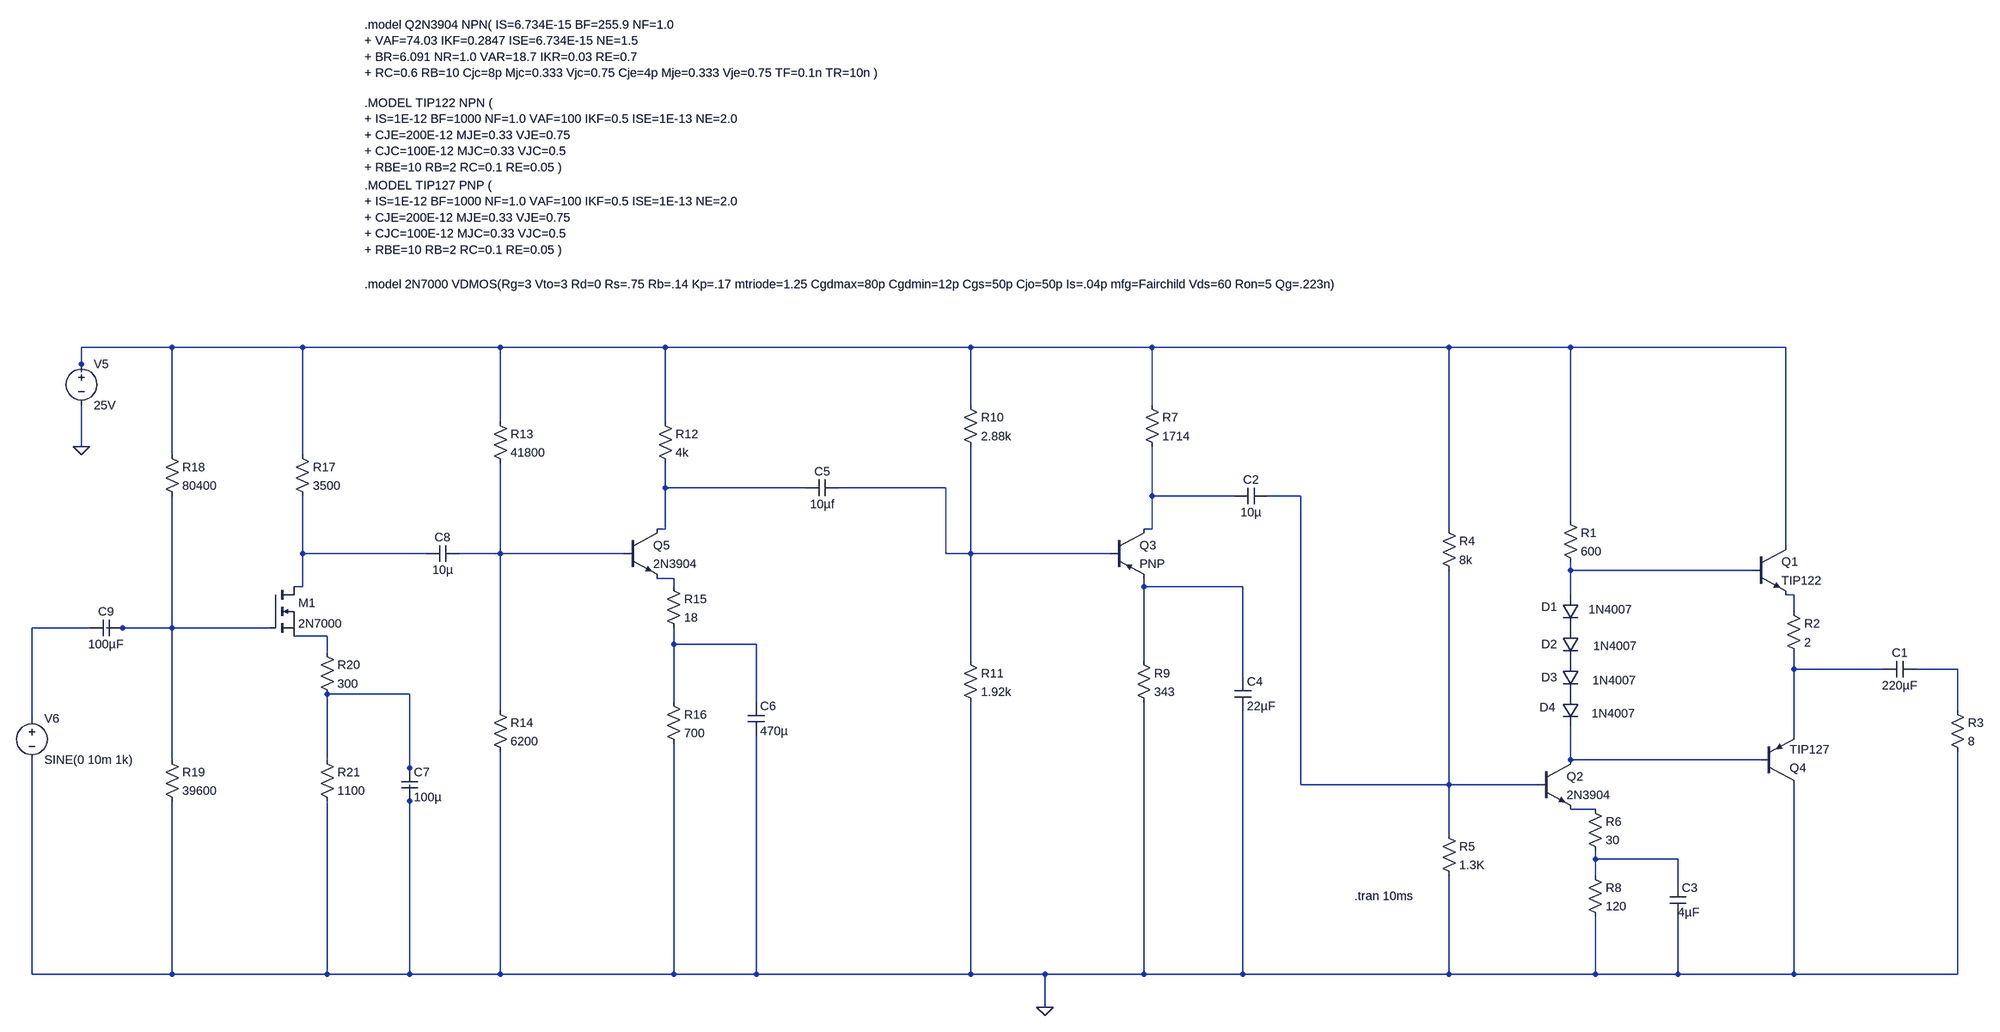
[diagram p0: schematic Audio_amp (1).asc]
Audio_amp (1).asc, the LTspice schematic file:
Version 4.1
SHEET 1 1880 1508
WIRE -2640 160 -2816 160
WIRE -2384 160 -2640 160
WIRE -2000 160 -2384 160
WIRE -1680 160 -2000 160
WIRE -1088 160 -1680 160
WIRE -736 160 -1088 160
WIRE -160 160 -736 160
WIRE 144 160 -160 160
WIRE 656 160 144 160
WIRE -2816 192 -2816 160
WIRE -2816 208 -2816 192
WIRE -1088 272 -1088 160
WIRE -736 272 -736 160
WIRE -2000 304 -2000 160
WIRE -1680 304 -1680 160
WIRE -2816 352 -2816 272
WIRE -2640 368 -2640 160
WIRE -2384 368 -2384 160
WIRE -1680 432 -1680 384
WIRE -1408 432 -1680 432
WIRE -1136 432 -1344 432
WIRE -736 448 -736 352
WIRE -576 448 -736 448
WIRE -448 448 -512 448
WIRE 144 496 144 160
WIRE -1680 512 -1680 432
WIRE -1680 512 -1696 512
WIRE -736 512 -736 448
WIRE -736 512 -752 512
WIRE -160 512 -160 160
WIRE 656 544 656 160
WIRE -2384 560 -2384 448
WIRE -2144 560 -2384 560
WIRE -2000 560 -2000 384
WIRE -2000 560 -2080 560
WIRE -1760 560 -2000 560
WIRE -1136 560 -1136 432
WIRE -1088 560 -1088 352
WIRE -1088 560 -1136 560
WIRE -816 560 -1088 560
WIRE 144 592 144 576
WIRE 592 592 144 592
WIRE -1664 608 -1696 608
WIRE -2384 624 -2384 560
WIRE -2384 624 -2400 624
WIRE -1664 624 -1664 608
WIRE -752 624 -752 608
WIRE -560 624 -752 624
WIRE 144 640 144 592
WIRE 672 640 656 640
WIRE 672 672 672 640
WIRE -2800 704 -2912 704
WIRE -2736 704 -2768 704
WIRE -2640 704 -2640 448
WIRE -2640 704 -2736 704
WIRE -2448 704 -2640 704
WIRE -2336 720 -2400 720
WIRE -1664 736 -1664 704
WIRE -1504 736 -1664 736
WIRE -2336 752 -2336 720
WIRE -1088 768 -1088 560
WIRE -752 768 -752 624
WIRE 672 784 672 752
WIRE 864 784 672 784
WIRE 1008 784 928 784
WIRE -560 800 -560 624
WIRE -2176 832 -2336 832
WIRE -1664 848 -1664 736
WIRE -1504 848 -1504 736
WIRE -2000 864 -2000 560
WIRE 1008 864 1008 784
WIRE -2912 880 -2912 704
WIRE 672 912 672 784
WIRE -2640 960 -2640 704
WIRE -2336 960 -2336 832
WIRE 144 960 144 896
WIRE 608 960 144 960
WIRE -2176 976 -2176 832
WIRE -2176 992 -2176 976
WIRE -448 1008 -448 448
WIRE -160 1008 -160 592
WIRE -160 1008 -448 1008
WIRE 80 1008 -160 1008
WIRE -2176 1040 -2176 1008
WIRE 192 1056 144 1056
WIRE -160 1104 -160 1008
WIRE 192 1152 192 1136
WIRE 352 1152 192 1152
WIRE 192 1184 192 1152
WIRE 352 1200 352 1152
WIRE -2912 1376 -2912 960
WIRE -2640 1376 -2640 1040
WIRE -2640 1376 -2912 1376
WIRE -2336 1376 -2336 1040
WIRE -2336 1376 -2640 1376
WIRE -2176 1376 -2176 1040
WIRE -2176 1376 -2336 1376
WIRE -2000 1376 -2000 944
WIRE -2000 1376 -2176 1376
WIRE -1664 1376 -1664 928
WIRE -1664 1376 -2000 1376
WIRE -1504 1376 -1504 912
WIRE -1504 1376 -1664 1376
WIRE -1088 1376 -1088 848
WIRE -1088 1376 -1504 1376
WIRE -944 1376 -1088 1376
WIRE -752 1376 -752 848
WIRE -752 1376 -944 1376
WIRE -560 1376 -560 864
WIRE -560 1376 -752 1376
WIRE -160 1376 -160 1184
WIRE -160 1376 -560 1376
WIRE 192 1376 192 1264
WIRE 192 1376 -160 1376
WIRE 352 1376 352 1264
WIRE 352 1376 192 1376
WIRE 672 1376 672 1008
WIRE 672 1376 352 1376
WIRE 1008 1376 1008 944
WIRE 1008 1376 672 1376
WIRE -944 1440 -944 1376
FLAG -2816 352 0
FLAG -944 1440 0
SYMBOL npn 592 544 R0
SYMATTR InstName Q1
SYMATTR Value TIP122
SYMBOL pnp 608 1008 M180
SYMATTR InstName Q4
SYMATTR Value TIP127
SYMBOL res 992 848 R0
SYMATTR InstName R3
SYMATTR Value 8
SYMBOL diode 128 640 R0
WINDOW 0 -41 23 Left 2
WINDOW 3 51 28 Left 2
SYMATTR InstName D1
SYMATTR Value 1N4007
SYMBOL diode 128 704 R0
WINDOW 0 -41 32 Left 2
WINDOW 3 60 35 Left 2
SYMATTR InstName D2
SYMATTR Value 1N4007
SYMBOL diode 128 768 R0
WINDOW 0 -41 32 Left 2
WINDOW 3 58 38 Left 2
SYMATTR InstName D3
SYMATTR Value 1N4007
SYMBOL diode 128 832 R0
WINDOW 0 -44 26 Left 2
WINDOW 3 57 38 Left 2
SYMATTR InstName D4
SYMATTR Value 1N4007
SYMBOL npn 80 960 R0
SYMATTR InstName Q2
SYMATTR Value 2N3904
SYMBOL cap -512 432 R90
WINDOW 0 0 32 VBottom 2
WINDOW 3 32 32 VTop 2
SYMATTR InstName C2
SYMATTR Value 10µ
SYMBOL res -176 496 R0
SYMATTR InstName R4
SYMATTR Value 8k
SYMBOL res -176 1088 R0
SYMATTR InstName R5
SYMATTR Value 1.3K
SYMBOL cap 336 1200 R0
WINDOW 3 16 56 Left 2
SYMATTR Value 4µF
SYMATTR InstName C3
SYMBOL res 656 656 R0
SYMATTR InstName R2
SYMATTR Value 2
SYMBOL res 176 1168 R0
SYMATTR InstName R8
SYMATTR Value 120
SYMBOL cap 928 768 R90
WINDOW 0 0 32 VBottom 2
WINDOW 3 32 32 VTop 2
SYMATTR InstName C1
SYMATTR Value 220µF
SYMBOL res 176 1040 R0
SYMATTR InstName R6
SYMATTR Value 30
SYMBOL pnp -816 512 R0
SYMATTR InstName Q3
SYMBOL res -752 256 R0
SYMATTR InstName R7
SYMATTR Value 1714
SYMBOL res -768 752 R0
SYMATTR InstName R9
SYMATTR Value 343
SYMBOL res -1104 256 R0
SYMATTR InstName R10
SYMATTR Value 2.88k
SYMBOL res -1104 752 R0
SYMATTR InstName R11
SYMATTR Value 1.92k
SYMBOL cap -576 800 R0
SYMATTR InstName C4
SYMATTR Value 22µF
SYMBOL cap -1344 416 R90
WINDOW 0 0 32 VBottom 2
WINDOW 3 32 32 VTop 2
SYMATTR InstName C5
SYMATTR Value 10µf
SYMBOL npn -1760 512 R0
SYMATTR InstName Q5
SYMATTR Value 2N3904
SYMBOL res -1696 288 R0
SYMATTR InstName R12
SYMATTR Value 4k
SYMBOL res -2016 288 R0
SYMATTR InstName R13
SYMATTR Value 41800
SYMBOL res -2016 848 R0
SYMATTR InstName R14
SYMATTR Value 6200
SYMBOL res -1680 608 R0
SYMATTR InstName R15
SYMATTR Value 18
SYMBOL res -1680 832 R0
SYMATTR InstName R16
SYMATTR Value 700
SYMBOL cap -1520 848 R0
SYMATTR InstName C6
SYMATTR Value 470µ
SYMBOL nmos -2448 624 R0
SYMATTR InstName M1
SYMATTR Value 2N7000
SYMBOL res -2400 352 R0
SYMATTR InstName R17
SYMATTR Value 3500
SYMBOL res -2656 352 R0
SYMATTR InstName R18
SYMATTR Value 80400
SYMBOL res -2656 944 R0
SYMATTR InstName R19
SYMATTR Value 39600
SYMBOL res -2352 736 R0
SYMATTR InstName R20
SYMATTR Value 300
SYMBOL res -2352 944 R0
SYMATTR InstName R21
SYMATTR Value 1100
SYMBOL voltage -2816 176 R0
WINDOW 123 0 0 Left 2
WINDOW 39 0 0 Left 2
SYMATTR InstName V5
SYMATTR Value 25V
SYMBOL cap -2192 976 R0
SYMATTR InstName C7
SYMATTR Value 100µ
SYMBOL voltage -2912 864 R0
WINDOW 123 0 0 Left 2
WINDOW 39 0 0 Left 2
SYMATTR InstName V6
SYMATTR Value SINE(0 10m 1k)
SYMBOL cap -2080 544 R90
WINDOW 0 0 32 VBottom 2
WINDOW 3 32 32 VTop 2
SYMATTR InstName C8
SYMATTR Value 10µ
SYMBOL cap -2736 688 R90
WINDOW 0 0 32 VBottom 2
WINDOW 3 32 32 VTop 2
SYMATTR InstName C9
SYMATTR Value 100µF
SYMBOL res 128 480 R0
SYMATTR InstName R1
SYMATTR Value 600
TEXT -2264 -216 Left 2 !.MODEL TIP127 PNP ( \n+ IS=1E-12 BF=1000 NF=1.0 VAF=100 IKF=0.5 ISE=1E-13 NE=2.0\n+ CJE=200E-12 MJE=0.33 VJE=0.75 \n+ CJC=100E-12 MJC=0.33 VJC=0.5\n+ RBE=10 RB=2 RC=0.1 RE=0.05 )
TEXT -2264 -376 Left 2 !.MODEL TIP122 NPN (\n+ IS=1E-12 BF=1000 NF=1.0 VAF=100 IKF=0.5 ISE=1E-13 NE=2.0\n+ CJE=200E-12 MJE=0.33 VJE=0.75 \n+ CJC=100E-12 MJC=0.33 VJC=0.5\n+ RBE=10 RB=2 RC=0.1 RE=0.05 )
TEXT -344 1224 Left 2 !.tran 10ms
TEXT -2264 -528 Left 2 !.model Q2N3904 NPN( IS=6.734E-15 BF=255.9 NF=1.0\n+ VAF=74.03 IKF=0.2847 ISE=6.734E-15 NE=1.5\n+ BR=6.091 NR=1.0 VAR=18.7 IKR=0.03 RE=0.7\n+ RC=0.6 RB=10 Cjc=8p Mjc=0.333 Vjc=0.75 Cje=4p Mje=0.333 Vje=0.75 TF=0.1n TR=10n )
TEXT -2264 -24 Left 2 !.model 2N7000 VDMOS(Rg=3 Vto=3 Rd=0 Rs=.75 Rb=.14 Kp=.17 mtriode=1.25 Cgdmax=80p Cgdmin=12p Cgs=50p Cjo=50p Is=.04p mfg=Fairchild Vds=60 Ron=5 Qg=.223n)

The netlist it stands for:
* Audio_amp (1).asc
Q1 N001 N008 N011 0 TIP122
Q4 0 N019 N016 0 TIP127
R3 N017 0 8
D1 N008 P001 1N4007
D2 P001 P002 1N4007
D3 P002 P003 1N4007
D4 P003 N019 1N4007
Q2 N019 N005 N020 0 2N3904
C2 N005 N004 10µ
R4 N001 N005 8k
R5 N005 0 1.3K
C3 N021 0 4µF
R2 N011 N016 2
R8 N021 0 120
C1 N017 N016 220µF
R6 N020 N021 30
Q3 N004 N003 N010 0 PNP
R7 N001 N004 1714
R9 N010 0 343
R10 N001 N003 2.88k
R11 N003 0 1.92k
C4 N010 0 22µF
C5 N003 N002 10µf
Q5 N002 N007 N009 0 2N3904
R12 N001 N002 4k
R13 N001 N007 41800
R14 N007 0 6200
R15 N009 N015 18
R16 N015 0 700
C6 N015 0 470µ
M1 N006 N013 N014 N014 2N7000
R17 N001 N006 3500
R18 N001 N013 80400
R19 N013 0 39600
R20 N014 N018 300
R21 N018 0 1100
V5 N001 0 25V
C7 N018 0 100µ
V6 N012 0 SINE(0 10m 1k)
C8 N007 N006 10µ
C9 N013 N012 100µF
R1 N001 N008 600
.model D D
.lib standard.dio
.model NPN NPN
.model PNP PNP
.lib standard.bjt
.model NMOS NMOS
.model PMOS PMOS
.lib standard.mos
.MODEL TIP127 PNP (
+ IS=1E-12 BF=1000 NF=1.0 VAF=100 IKF=0.5 ISE=1E-13 NE=2.0
+ CJE=200E-12 MJE=0.33 VJE=0.75
+ CJC=100E-12 MJC=0.33 VJC=0.5
+ RBE=10 RB=2 RC=0.1 RE=0.05 )
.MODEL TIP122 NPN (
+ IS=1E-12 BF=1000 NF=1.0 VAF=100 IKF=0.5 ISE=1E-13 NE=2.0
+ CJE=200E-12 MJE=0.33 VJE=0.75
+ CJC=100E-12 MJC=0.33 VJC=0.5
+ RBE=10 RB=2 RC=0.1 RE=0.05 )
.tran 10ms
.model Q2N3904 NPN( IS=6.734E-15 BF=255.9 NF=1.0
+ VAF=74.03 IKF=0.2847 ISE=6.734E-15 NE=1.5
+ BR=6.091 NR=1.0 VAR=18.7 IKR=0.03 RE=0.7
+ RC=0.6 RB=10 Cjc=8p Mjc=0.333 Vjc=0.75 Cje=4p Mje=0.333 Vje=0.75 TF=0.1n TR=10n )
.model 2N7000 VDMOS(Rg=3 Vto=3 Rd=0 Rs=.75 Rb=.14 Kp=.17 mtriode=1.25 Cgdmax=80p Cgdmin=12p Cgs=50p Cjo=50p Is=.04p mfg=Fairchild Vds=60 Ron=5 Qg=.223n)
.backanno
.end